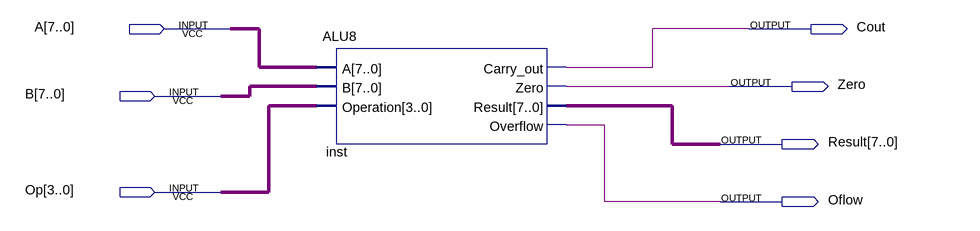
[diagram p0: schematic sheet]
// Quartus schematic TestALU8.bdf as structural Verilog: 1 symbols, 7 pins
module TestALU8 (
  input  [7:0] A,
  input  [7:0] B,
  input  [3:0] Op,
  output Cout,
  output Zero,
  output [7:0] Result,
  output Oflow
);

  ALU8 inst (.A(A), .B(B), .Operation(Op), .Carry_out(Cout), .Zero(Zero), .Result(Result), .Overflow(Oflow));
endmodule
